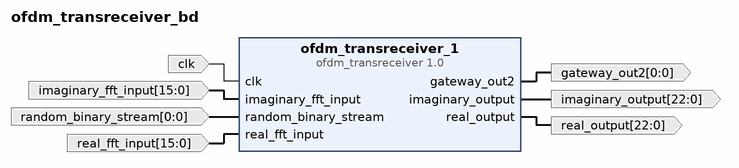
[diagram p0: block diagram of the top level]
# Vivado block design ofdm_transreceiver_bd, xc7a35ticpg236-1L, Vivado 2020.2
create_bd_design ofdm_transreceiver_bd

create_bd_port -dir I -type clk clk
create_bd_port -dir O -from 0 -to 0 -type data gateway_out2
create_bd_port -dir I -from 15 -to 0 -type data imaginary_fft_input
create_bd_port -dir O -from 22 -to 0 -type data imaginary_output
create_bd_port -dir I -from 0 -to 0 -type data random_binary_stream
create_bd_port -dir I -from 15 -to 0 -type data real_fft_input
create_bd_port -dir O -from 22 -to 0 -type data real_output

create_bd_cell -type ip -vlnv User_Company:SysGen:ofdm_transreceiver:1.0 ofdm_transreceiver_1

# ---- connections ----

connect_bd_net [get_bd_ports clk] [get_bd_pins ofdm_transreceiver_1/clk]
connect_bd_net [get_bd_pins ofdm_transreceiver_1/gateway_out2] [get_bd_ports gateway_out2]
connect_bd_net [get_bd_ports imaginary_fft_input] [get_bd_pins ofdm_transreceiver_1/imaginary_fft_input]
connect_bd_net [get_bd_pins ofdm_transreceiver_1/imaginary_output] [get_bd_ports imaginary_output]
connect_bd_net [get_bd_ports random_binary_stream] [get_bd_pins ofdm_transreceiver_1/random_binary_stream]
connect_bd_net [get_bd_ports real_fft_input] [get_bd_pins ofdm_transreceiver_1/real_fft_input]
connect_bd_net [get_bd_pins ofdm_transreceiver_1/real_output] [get_bd_ports real_output]

validate_bd_design
save_bd_design
